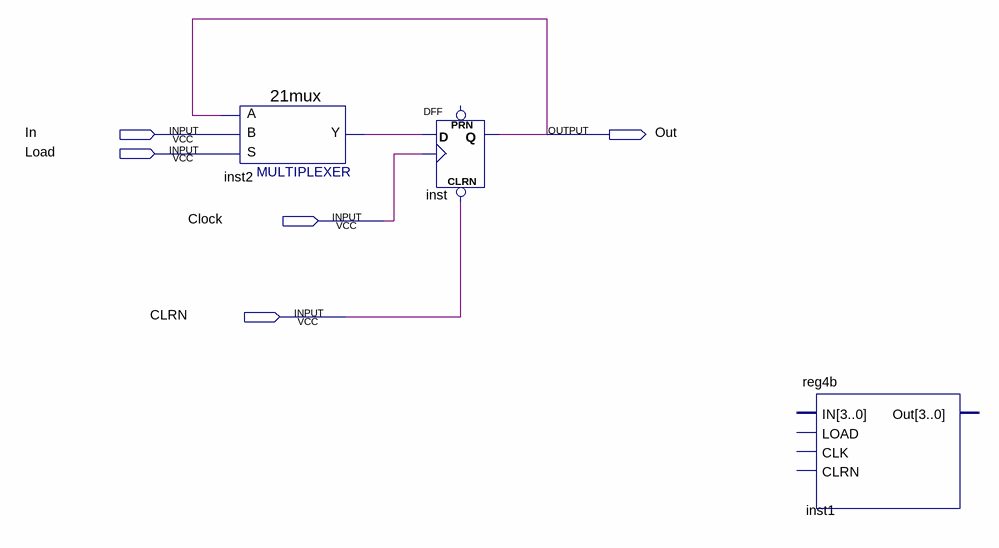
[diagram p0: schematic sheet]
// Quartus schematic register.bdf as structural Verilog: 3 symbols, 5 pins
module register (
  input  In,
  input  Load,
  input  Clock,
  input  CLRN,
  output Out
);

  wire inst2_y;

  \21mux  inst2 (.S(Load), .B(In), .A(Out), .Y(inst2_y));
  DFF inst (.CLRN(CLRN), .CLK(Clock), .D(inst2_y), .Q(Out));  // open: PRN
  reg4b inst1 ();  // open: IN, LOAD, CLK, CLRN, Out
endmodule
